# Altium schematic sheet H204_R_Sensors.SchDoc: H204 - Sensors
size A3; SheetNumber: 3; SheetTotal: 3; PageSetup: Record=PageOptions|CenterHorizontal=True|CenterVertical=True|PrintScale=0.63|XCorrection=1.00|YCorrection=1.00|PrintKind=0|BorderSize=5000000|LeftOffset=0|BottomOffset=0|Orientation=2|PaperLength=2794|PaperWidth=4318|Scale=100|PaperSource=7|PrintQuality=600|MediaType=1|DitherType=10|PaperKind=Legal (8 ½ x 14 in)|PrintScaleMode=1
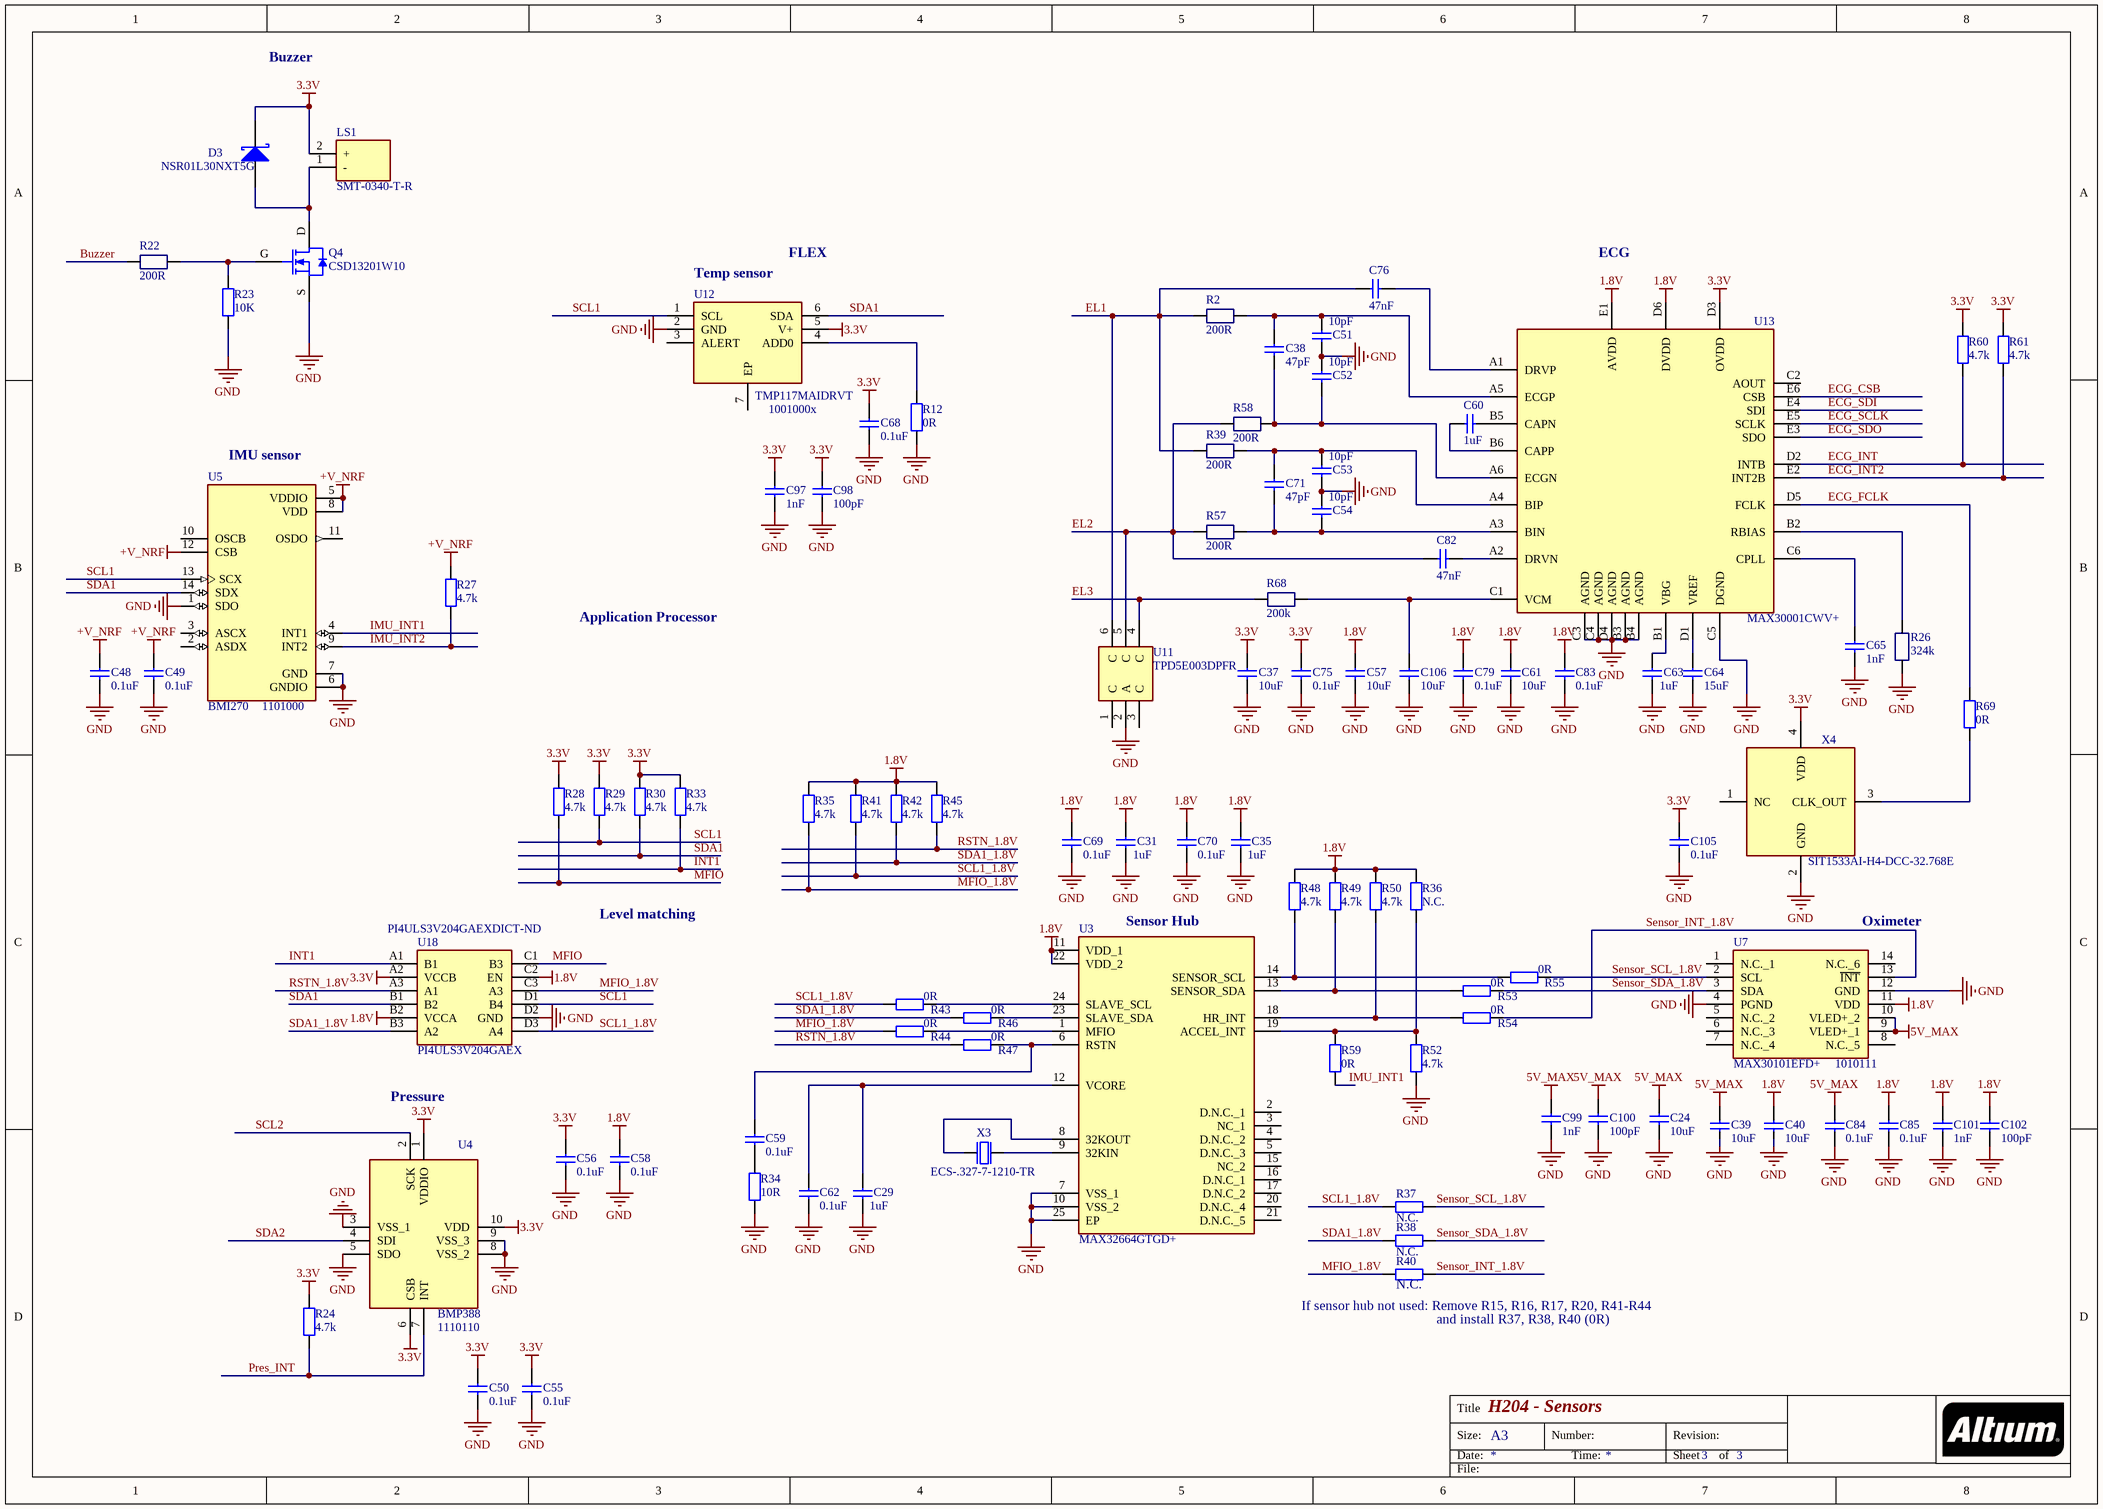
[diagram p0: H204_R_Sensors.SchDoc]

## Parts
C24  10uF  [CAPC1005X55N]
C29  1uF  [CAPC0603X33N]
C31  1uF  [CAPC0603X33N]
C35  1uF  [CAPC0603X33N]
C37  10uF  [CAPC1005X55N]
C38  47pF  [CAPC0603X33N]
C39  10uF  [CAPC1005X55N]
C40  10uF  [CAPC1005X55N]
C48  0.1uF  [CAPC0603X33N]
C49  0.1uF  [CAPC0603X33N]
C50  0.1uF  [CAPC0603X33N]
C51  10pF  [CAPC0603X33N]
C52  10pF  [CAPC0603X33N]
C53  10pF  [CAPC0603X33N]
C54  10pF  [CAPC0603X33N]
C55  0.1uF  [CAPC0603X33N]
C56  0.1uF  [CAPC0603X33N]
C57  10uF  [CAPC1005X55N]
C58  0.1uF  [CAPC0603X33N]
C59  0.1uF  [CAPC0603X33N]
C60  1uF  [CAPC0603X33N]
C61  10uF  [CAPC1005X55N]
C62  0.1uF  [CAPC0603X33N]
C63  1uF  [CAPC0603X33N]
C64  15uF  [CAPC1005X55N]
C65  1nF  [CAPC0603X33N]
C68  0.1uF  [CAPC0603X33N]
C69  0.1uF  [CAPC0603X33N]
C70  0.1uF  [CAPC0603X33N]
C71  47pF  [CAPC0603X33N]
C75  0.1uF  [CAPC0603X33N]
C76  47nF  [CAPC0603X33N]
C79  0.1uF  [CAPC0603X33N]
C82  47nF  [CAPC0603X33N]
C83  0.1uF  [CAPC0603X33N]
C84  0.1uF  [CAPC0603X33N]
C85  0.1uF  [CAPC0603X33N]
C97  1nF  [CAPC0603X33N]
C98  100pF  [CAPC0603X33N]
C99  1nF  [CAPC0603X33N]
C100  100pF  [CAPC0603X33N]
C101  1nF  [CAPC0603X33N]
C102  100pF  [CAPC0603X33N]
C105  0.1uF  [CAPC0603X33N]
C106  10uF  [CAPC1005X55N]
D3  NSR01L30NXT5G  [NSR01L30NXT5G]
LS1  SMT-0340-T-R  [SMT0340TR]
Q4  CSD13201W10  [CSD13201W10]
R2  200R  [RESC0603X26N]
R12  0R  [RESC0603X26N]
R22  200R  [RESC0603X26N]
R23  10k  [RESC0603X26N]
R24  4.7k  [RESC0603X26N]
R26  324k  [RESC0603X26N]
R27  4.7k  [RESC0603X26N]
R28  4.7k  [RESC0603X26N]
R29  4.7k  [RESC0603X26N]
R30  4.7k  [RESC0603X26N]
R33  4.7k  [RESC0603X26N]
R34  10R  [RESC0603X26N]
R35  4.7k  [RESC0603X26N]
R36  N.C.  [RESC0603X26N]
R37  N.C.  [RESC0603X26N]
R38  N.C.  [RESC0603X26N]
R39  200R  [RESC0603X26N]
R40  N.C.  [RESC0603X26N]
R41  4.7k  [RESC0603X26N]
R42  4.7k  [RESC0603X26N]
R43  0R  [RESC0603X26N]
R44  0R  [RESC0603X26N]
R45  4.7k  [RESC0603X26N]
R46  0R  [RESC0603X26N]
R47  0R  [RESC0603X26N]
R48  4.7k  [RESC0603X26N]
R49  4.7k  [RESC0603X26N]
R50  4.7k  [RESC0603X26N]
R52  4.7k  [RESC0603X26N]
R53  0R  [RESC0603X26N]
R54  0R  [RESC0603X26N]
R55  0R  [RESC0603X26N]
R57  200R  [RESC0603X26N]
R58  200R  [RESC0603X26N]
R59  0R  [RESC0603X26N]
R60  4.7k  [RESC0603X26N]
R61  4.7k  [RESC0603X26N]
R68  200k  [RESC0603X26N]
R69  0R  [RESC0603X26N]
U3  MAX32664GTGD+  [MAX32664GTGD]
U4  BMP388  [BMP388]
U5  BMI270  [XDCR_BMI270]
U7  MAX30101EFD+  [14-LEAD-OESIP]
U11  TPD5E003DPFR  [SON35P100X100X40-6N]
U12  TMP117MAIDRVT  [SON65P200X200X80-7N]
U13  MAX30001CWV+  [BGA30C50P6X5_293X274X69]
U18  PI4ULS3V204GAEX  Supplier Part Number 1: PI4ULS3V204GAEXDICT-ND  [BGA12C50P3X4_137X187X62]
X3  ECS-.327-7-1210-TR  [XTAL_ECS-.327-7-1210-TR]
X4  SIT1533AI-H4-DCC-32.768E  [SIT1533AIH4DCC32768E]

## Nets
1.8V: C31.1 C35.1 C40.1 C57.1 C58.1 C61.1 C69.1 C70.1 C79.1 C83.1 C85.1 C101.2 C102.1 R35.1 R36.1 R41.1 R42.1 R45.1 R48.1 R49.1 R50.1 U3.11(VDD_1) U3.22(VDD_2) U7.11(VDD) U13.D6(DVDD) U13.E1(AVDD) U18.B2(VCCA) U18.C2(EN)
3.3V: C37.1 C50.1 C55.1 C56.1 C68.1 C75.1 C97.2 C98.1 C105.1 D3.2(K) LS1.2(+) R24.1 R28.1 R29.1 R30.1 R33.1 R60.1 R61.1 U4.1(VDDIO) U4.6(CSB) U4.10(VDD) U12.5(V+) U13.D3(OVDD) U18.A2(VCCB) X4.4(VDD)
5V_MAX: C24.1 C39.1 C84.1 C99.2 C100.1 U7.9(VLED+_1) U7.10(VLED+_2)
+V_NRF: C48.1 C49.1 R27.1 U5.5(VDDIO) U5.8(VDD) U5.12(CSB)
GND: C24.2 C29.2 C31.2 C35.2 C37.2 C39.2 C40.2 C48.2 C49.2 C50.2 C51.1 C52.2 C53.1 C54.2 C55.2 C56.2 C57.2 C58.2 C61.2 C62.2 C63.2 C64.2 C65.2 C68.2 C69.2 C70.2 C75.2 C79.2 C83.2 C84.2 C85.2 C97.1 C98.2 C99.1 C100.2 C101.1 C102.2 C105.2 C106.2 Q4.S R12.1 R23.2 R26.1 R34.2 R52.2 U3.7(VSS_1) U3.10(VSS_2) U3.25(EP) U4.3(VSS_1) U4.5(SDO) U4.8(VSS_2) U4.9(VSS_3) U5.1(SDO) U5.6(GNDIO) U5.7(GND) U7.4(PGND) U7.12(GND) U11.2(A) U12.2(GND) U13.B3(AGND) U13.B4(AGND) U13.C3(AGND) U13.C4(AGND) U13.C5(DGND) U13.D4(AGND) U18.D2(GND) X4.2(GND)
Buzzer: R22.1
ECG_CSB: U13.E6(CSB)
ECG_FCLK: R69.2 U13.D5(FCLK)
ECG_INT: R60.2 U13.D2(INTB)
ECG_INT2: R61.2 U13.E2(INT2B)
ECG_SCLK: U13.E5(SCLK)
ECG_SDI: U13.E4(SDI)
ECG_SDO: U13.E3(SDO)
EL1: C76.2 R2.1 R39.1 U11.6(C)
EL2: C82.2 R57.1 R58.1 U11.5(C)
EL3: R68.2 U11.4(C)
IMU_INT1: R59.2 U5.4(INT1)
IMU_INT2: R27.2 U5.9(INT2)
INT1: R33.2 U18.A1(B1)
MFIO: R28.2 U18.C1(B3)
MFIO_1.8V: R35.2 R40.2 R44.1 U18.C3(A3)
Pres_INT: R24.2 U4.7(INT)
RSTN_1.8V: R45.2 R47.1 U18.A3(A1)
SCL1: R29.2 U5.13(SCX) U12.1(SCL) U18.D1(B4)
SCL1_1.8V: R37.2 R41.2 R43.1 U18.D3(A4)
SCL2: U4.2(SCK)
SDA1: R30.2 U5.14(SDX) U12.6(SDA) U18.B1(B2)
SDA1_1.8V: R38.2 R42.2 R46.1 U18.B3(A2)
SDA2: U4.4(SDI)
Sensor_INT_1.8V: R40.1 R54.2 U7.13(~{INT})
Sensor_SCL_1.8V: R37.1 R55.2 U7.2(SCL)
Sensor_SDA_1.8V: R38.1 R53.2 U7.3(SDA)
NetC29_1: C29.1 C62.1 U3.12(VCORE)
NetC38_1: C38.1 C52.1 R58.2 U13.A6(ECGN)
NetC38_2: C38.2 C51.2 R2.2 U13.A5(ECGP)
NetC53_2: C53.2 C71.2 R39.2 U13.A4(BIP)
NetC54_1: C54.1 C71.1 R57.2 U13.A3(BIN)
NetC59_1: C59.1 R47.2 U3.6(RSTN)
NetC59_2: C59.2 R34.1
NetC60_1: C60.1 U13.B6(CAPP)
NetC60_2: C60.2 U13.B5(CAPN)
NetC63_1: C63.1 U13.B1(VBG)
NetC64_1: C64.1 U13.D1(VREF)
NetC65_1: C65.1 U13.C6(CPLL)
NetC76_1: C76.1 U13.A1(DRVP)
NetC82_1: C82.1 U13.A2(DRVN)
NetC106_1: C106.1 R68.1 U13.C1(VCM)
NetD3_1: D3.1(A) LS1.1(-) Q4.D
NetQ4_G: Q4.G R22.2 R23.1
NetR12_2: R12.2 U12.4(ADD0)
NetR26_2: R26.2 U13.B2(RBIAS)
NetR36_2: R36.2 R52.1 R59.1 U3.19(ACCEL_INT)
NetR43_2: R43.2 U3.24(SLAVE_SCL)
NetR44_2: R44.2 U3.1(MFIO)
NetR46_2: R46.2 U3.23(SLAVE_SDA)
NetR48_2: R48.2 R55.1 U3.14(SENSOR_SCL)
NetR49_2: R49.2 R53.1 U3.13(SENSOR_SDA)
NetR50_2: R50.2 R54.1 U3.18(HR_INT)
NetR69_1: R69.1 X4.3(CLK_OUT)
NetU3_8: U3.8(32KOUT) X3.1(inp)
NetU3_9: U3.9(32KIN) X3.2(out)

Not connected (* = marked no-connect by the designer): U3 2(D.N.C._1) 3(NC_1) 4(D.N.C._2) 5(D.N.C._3) 15(NC_2) 16(D.N.C_1) 17(D.N.C_2) 20(D.N.C._4) 21(D.N.C._5); U5 2(ASDX) 3(ASCX) 10(OSCB) 11(OSDO); U7 1(N.C._1) 5(N.C._2) 6(N.C._3) 7(N.C._4) 8(N.C._5) 14(N.C._6); U11 1(C) 3(C); U12 3(ALERT) 7(EP); U13 C2(AOUT); X4 1(NC)

## Notes on the sheet
- Buzzer
- (near U12) Temp sensor
- FLEX
- ECG
- (near U12) 1001000x
- (near U5) IMU sensor
- Application Processor
- (near U5) 1101000
- Level matching
- (near U3) Sensor Hub
- (near U7) Oximeter
- Pressure
- (near U7) 1010111
- (near R40) If sensor hub not used: Remove R15, R16, R17, R20, R41-R44
- (near R40) and install R37, R38, R40 (0R)
- (near U4) 1110110
- Title
- Size:
- Date:
- A3
- Number:
- Time:
- Revision:
- Sheet
- of
- File:

## Library data of the parts
C24 C37 C39 C40 C57 C61 C106 = C0603-4µ7: CAP CER 10UF 10V X5R 0402; Manufacturer: Samsung; Manufacturer Part Number: CL05A106MP8NUB8; Tolerance: 20%; Value: 10uF; Supplier 1: Digi-Key; Supplier Part Number 1: 1276-6830-2-ND; RoHS: Yes; Category: Ceramic Capacitors; Stock 1: 5635891; Pricing 1: 8000=0,08247 (USD); Mount: Surface Mount; Case/Package: 0402; Case Code (Metric): 1005; Case Code (Imperial): 0402; Min Operating Temperature: -55°C; Max Operating Temperature: 85°C; Packaging: Tape and Reel; Capacitance: 10uF; Voltage Rating: 10V; Length: 0.039inch; Width: 0.02inch; Thickness: 0.035inch; RoHS Compliant: Yes; ComponentLink1URL: http://www.samsungsem.com/kr/support/product-search/mlcc/CL05A106MP8NUB8.jsp?src-supplier=Digi-Key; ComponentLink1Description: http://www.samsungsem.com/kr/support/product-search/mlcc/CL05A106MP8NUB8.jsp?src-supplier=Digi-Key
C29 C31 C35 C60 C63 = C0402-1µ0: CAP CER 1UF 6.3V X5R 0201; Manufacturer: Samsung; Manufacturer Part Number: CL03A105MQ3CSNC; Tolerance: 20%; Supplier 1: Digi-Key; Supplier Part Number 1: 1276-1325-1-ND; RoHS: Yes; Category: Ceramic Capacitors; Stock 1: 10; Pricing 1: 1=0,10000, 10=0,03500, 50=0,01940, 100=0,01580, 500=0,01128, 1000=0,00886, 2500=0,00805, 5000=0,00741 (USD); Mount: Surface Mount; Case/Package: 0201; Case Code (Metric): 0603; Case Code (Imperial): 0201; Min Operating Temperature: -55°C; Max Operating Temperature: 85°C; Package Quantity: 1; Packaging: Tape and Reel; Capacitance: 1uF; Voltage Rating: 6.3V; Dielectric: X5R; Series: CL; Length: 0.024inch; Width: 0.012inch; Thickness: 0.013inch; Depth: 0.3mm; Lead Free: Lead Free; RoHS Compliant: Yes; ComponentLink1URL: https://datasheet.ciiva.com/25786/cl03a105mq3csnc-25786759.pdf?src-supplier=Digi-Key; ComponentLink1Description: https://datasheet.ciiva.com/25786/cl03a105mq3csnc-25786759.pdf?src-supplier=Digi-Key; Value: 1uF
C38 C71 = C0402-100n: Cap Ceramic Monolithic 47pF 50VDC 1% SMD Paper T/R; Manufacturer: Murata; Manufacturer Part Number: GRM0335C1H470FA01D; Supplier 1: Digi-Key; Supplier Part Number 1: 490-GRM0335C1H470FA01DCT-ND; RoHS: Yes; Category: Ceramic Capacitors; Stock 1: 73266; Pricing 1: 1=0,10000, 10=0,02200, 50=0,01180, 100=0,00960, 500=0,00688, 1000=0,00541, 2500=0,00492, 5000=0,00452 (USD); RoHS Compliant: Yes
C48-C50 C55 C56 C58 C59 C62 C68-C70 C75 C79 C83-C85 C105 = C0201-100n: CAP CER 0.1UF 16V X5R 0201; Manufacturer: Samsung; Manufacturer Part Number: CL03A104KO3NNNC; Capacitance: 100nF; Tolerance: 10%; Value: 0.1uF; Supplier 1: Digi-Key; Supplier Part Number 1: 1276-1319-1-ND; RoHS: Yes; Category: Ceramic Capacitors; Stock 1: 1005663; Pricing 1: 1=0,12000, 10=0,08500, 50=0,04640, 100=0,03790, 500=0,02704, 1000=0,02125, 2500=0,01932, 5000=0,01777 (USD); Mount: Surface Mount; Case/Package: 0201; Case Code (Metric): 0603; Case Code (Imperial): 0201; Contact Plating: Tin; Min Operating Temperature: -55°C; Max Operating Temperature: 85°C; Package Quantity: 1; Packaging: Tape and Reel; Voltage Rating: 16V; Dielectric: X5R; Voltage Rating (DC): 16V; Series: CL; Construction: Flat; Length: 0.6mm; Width: 0.012inch; Height: 0.3mm; Thickness: 0.013inch; Depth: 0.3mm; Radiation Hardening: No; RoHS Compliant: Yes; ComponentLink1URL: https://datasheet.ciiva.com/25794/cl03a104ko3nnnc-25794320.pdf?src-supplier=Digi-Key; ComponentLink1Description: https://datasheet.ciiva.com/25794/cl03a104ko3nnnc-25794320.pdf?src-supplier=Digi-Key; ComponentLink2URL: https://datasheet.ciiva.com/26838/getdatasheetpartid-359638-26838082.pdf?src-supplier=Verical; ComponentLink2Description: https://datasheet.ciiva.com/26838/getdatasheetpartid-359638-26838082.pdf?src-supplier=Verical
C51-C54 = C0402-100n: MURATA - GRM0335C1H100JA01D - SMD Multilayer Ceramic Capacitor, 10 pF, 50 V, 0201 [0603 Metric], ± 5%, C0G / NP0, GRM Series; Voltage Rating: 50V; Supplier 1: Digi-Key; Supplier Part Number 1: 490-6112-1-ND; Manufacturer: Murata; Manufacturer Part Number: GRM0335C1H100JA01D; RoHS: Yes; Category: Ceramic Capacitors; Stock 1: 536566; Pricing 1: 1=0,10000, 10=0,01100, 50=0,00620, 100=0,00510, 500=0,00362, 1000=0,00285, 2500=0,00259, 5000=0,00238 (USD); Mount: Surface Mount; Case/Package: 0201; Case Code (Metric): 0603; Case Code (Imperial): 0201; Min Operating Temperature: -55°C; Max Operating Temperature: 125°C; Capacitance: 10pF; Tolerance: 5%; Voltage Rating (DC): 50V; Packaging: Tape and Reel; Package Quantity: 15000; Dielectric: C0G; Termination: SMD/SMT; Voltage: 50V; Series: GRM; Length: 0.6mm; Width: 0.3mm; Height: 0.3mm; Thickness: 0.013inch; Depth: 0.3mm; REACH SVHC: No SVHC; Lead Free: Lead Free; RoHS Compliant: Yes; ComponentLink1URL: https://datasheet.ciiva.com/6271/partnumbering-e-01-6271173.pdf?src-supplier=Digi-Key; ComponentLink1Description: https://datasheet.ciiva.com/6271/partnumbering-e-01-6271173.pdf?src-supplier=Digi-Key; ComponentLink2URL: https://datasheet.ciiva.com/6271/partnumbering-e-01-6271176.pdf?src-supplier=Digi-Key; ComponentLink2Description: https://datasheet.ciiva.com/6271/partnumbering-e-01-6271176.pdf?src-supplier=Digi-Key; ComponentLink3URL: https://datasheet.ciiva.com/6271/partnumbering-e-01-6271177.pdf?src-supplier=Digi-Key; ComponentLink3Description: https://datasheet.ciiva.com/6271/partnumbering-e-01-6271177.pdf?src-supplier=Digi-Key
C64 = C0603-4µ7: Cap Ceramic Monolithic 15uF 6.3VDC 20% SMD Paper T/R; Manufacturer: Murata; Manufacturer Part Number: GRM155R60J156ME05D; Value: 15uF; Supplier 1: Digi-Key; Supplier Part Number 1: 490-18659-1-ND; RoHS: Yes; Category: Ceramic Capacitors; Stock 1: 130616; Pricing 1: 1=0,28000, 10=0,19500, 50=0,13020, 100=0,11070, 500=0,07810, 1000=0,06834, 2500=0,06509, 5000=0,06021 (USD); RoHS Compliant: Yes
C65 C97 C99 C101 = C0402-100n: Cap Ceramic 0.001uF 25V X7R 10% SMD 0201 125C Paper T/R; Manufacturer: Samsung; Manufacturer Part Number: CL03B102KA3NNNC; Value: 1nF; Supplier 1: Digi-Key; Supplier Part Number 1: 1276-1341-1-ND; RoHS: Yes; Category: Ceramic Capacitors; Stock 1: 1034478; Pricing 1: 1=0,13000, 10=0,08900, 50=0,05080, 100=0,04200, 500=0,02946, 1000=0,02439, 2500=0,02270, 5000=0,02077 (USD); Mount: Surface Mount; Case/Package: 0201; Contact Plating: Tin; Case Code (Metric): 0603; Case Code (Imperial): 0201; Min Operating Temperature: -55°C; Max Operating Temperature: 125°C; Package Quantity: 1; Packaging: Tape and Reel; Capacitance: 1nF; Tolerance: 10%; Dielectric: X7R; Voltage Rating: 25V; Series: CL; Construction: Flat; Length: 0.6mm; Width: 0.012inch; Height: 0.3mm; Thickness: 0.013inch; Depth: 0.3mm; Radiation Hardening: No; RoHS Compliant: Yes; ComponentLink1URL: https://datasheet.ciiva.com/25788/cl03b102ka3nnnc-25788656.pdf?src-supplier=Digi-Key; ComponentLink1Description: https://datasheet.ciiva.com/25788/cl03b102ka3nnnc-25788656.pdf?src-supplier=Digi-Key; ComponentLink2URL: https://datasheet.ciiva.com/26838/getdatasheetpartid-355161-26838110.pdf?src-supplier=Verical; ComponentLink2Description: https://datasheet.ciiva.com/26838/getdatasheetpartid-355161-26838110.pdf?src-supplier=Verical
C76 C82 = C0402-100n: CAP CER 0.047UF 25V X5R 0201; Manufacturer: TDK; Manufacturer Part Number: C0603X5R1E473K030BB; Dielectric Material: Ceramic; Tolerance: 10%; Supplier 1: Digi-Key; Supplier Part Number 1: 445-13679-1-ND; RoHS: Yes; Category: Ceramic Capacitors; Stock 1: 131887; Pricing 1: 1=0,10000, 10=0,07600, 50=0,04140, 100=0,03380, 500=0,02416, 1000=0,01898, 2500=0,01725, 5000=0,01587 (USD); Mount: Surface Mount; Case/Package: 0201; Case Code (Metric): 0603; Case Code (Imperial): 0201; Weight: 6E-06oz; Min Operating Temperature: -55°C; Max Operating Temperature: 85°C; Package Quantity: 15000; Packaging: Tape and Reel; Capacitance: 47nF; Voltage Rating: 25V; Dielectric: X5R; Termination: SMD/SMT; Voltage Rating (DC): 25V; Series: C; Length: 0.024inch; Width: 0.3mm; Height: 0.3mm; Thickness: 0.013inch; Lead Free: Lead Free; RoHS Compliant: Yes; ComponentLink1URL: https://datasheet.ciiva.com/14887/tdkmlcccaprange-14887813.pdf?src-supplier=Digi-Key; ComponentLink1Description: https://datasheet.ciiva.com/14887/tdkmlcccaprange-14887813.pdf?src-supplier=Digi-Key; ComponentLink2URL: https://datasheet.ciiva.com/14887/tdkmlcccaprange-14887815.pdf?src-supplier=Digi-Key; ComponentLink2Description: https://datasheet.ciiva.com/14887/tdkmlcccaprange-14887815.pdf?src-supplier=Digi-Key; ComponentLink3URL: https://datasheet.ciiva.com/14887/tdkmlcccaprange-14887817.pdf?src-supplier=Digi-Key; ComponentLink3Description: https://datasheet.ciiva.com/14887/tdkmlcccaprange-14887817.pdf?src-supplier=Digi-Key
C98 C100 C102 = C0402-100n: CAP CER 100PF 50V C0G 0201; Manufacturer: TDK; Manufacturer Part Number: C0603C0G1H101J030BA; Dielectric Material: Ceramic; Tolerance: 5%; Insulation Resistance: 10GR; Value: 100pF; Supplier 1: Digi-Key; Supplier Part Number 1: 445-1786-1-ND; RoHS: Yes; Category: Ceramic Capacitors; Stock 1: 312493; Pricing 1: 1=0,10000, 10=0,06800, 50=0,03720, 100=0,03040, 500=0,02174, 1000=0,01708, 2500=0,01552, 5000=0,01428 (USD); Mount: Surface Mount; Case/Package: 0201; Number of Pins: 2; Case Code (Metric): 0603; Case Code (Imperial): 0201; Weight: 6E-06oz; Min Operating Temperature: -55°C; Max Operating Temperature: 125°C; Package Quantity: 1; Capacitance: 100pF; Voltage Rating: 50V; Packaging: Tape and Reel; Voltage Rating (DC): 50V; Dielectric: C0G; Termination: SMD/SMT; Construction: Flat; Voltage: 50V; Series: C; Length: 0.6mm; Width: 0.012inch; Height: 0.3mm; Depth: 0.3mm; Thickness: 0.013inch; Lead Free: Lead Free; REACH SVHC: Unknown; RoHS Compliant: Yes; ComponentLink1URL: https://datasheet.ciiva.com/24217/c0603c0g1h101j030ba-264106-24217425.pdf?src-supplier=Mouser; ComponentLink1Description: https://datasheet.ciiva.com/24217/c0603c0g1h101j030ba-264106-24217425.pdf?src-supplier=Mouser; ComponentLink2URL: https://datasheet.ciiva.com/16205/mlcc-commercial-general-en-16205590.pdf?src-supplier=Future+Electronics; ComponentLink2Description: https://datasheet.ciiva.com/16205/mlcc-commercial-general-en-16205590.pdf?src-supplier=Future+Electronics; ComponentLink3URL: https://datasheet.ciiva.com/6250/tdkmlcccaprange-6250351.pdf?src-supplier=Digi-Key; ComponentLink3Description: https://datasheet.ciiva.com/6250/tdkmlcccaprange-6250351.pdf?src-supplier=Digi-Key
D3 = Schottky: ON SEMICONDUCTOR - NSR01L30NXT5G - Small Signal Schottky Diode, Single, 30 V, 100 mA, 530 mV, 4 A, 150 °C; Forward Voltage: 530mV; Forward Current: 100mA; Max Repetitive Reverse Voltage (Vrrm): 30V; Max Forward Surge Current (Ifsm): 4A; Max Reverse Current: 3uA; Supplier 1: Digi-Key; Supplier Part Number 1: NSR01L30NXT5GOSCT-ND; Manufacturer: ON Semiconductor; Manufacturer Part Number: NSR01L30NXT5G; RoHS: Yes; Category: Schottky Diodes; Stock 1: 38186; Pricing 1: 1=0,43000, 10=0,32300, 100=0,20140, 500=0,13780, 1000=0,10600, 2000=0,09540 (USD); Case/Package: 0201; Number of Pins: 2; Max Operating Temperature: 150°C; Package Quantity: 5000; Packaging: Tape and Reel; Series: -; Average Rectified Current: 100mA; Peak Non-Repetitive Surge Current: 4A; Element Configuration: Single; Max Reverse Voltage (DC): 30V; Radiation Hardening: No; RoHS Compliant: Yes; REACH SVHC: No SVHC; Lead Free: Lead Free; ComponentLink1URL: https://datasheet.ciiva.com/4714/nsr01l30-d-118977-4714835.pdf?src-supplier=Mouser; ComponentLink1Description: https://datasheet.ciiva.com/4714/nsr01l30-d-118977-4714835.pdf?src-supplier=Mouser; ComponentLink2URL: https://datasheet.ciiva.com/22659/nsr01l30-d-22659110.pdf?src-supplier=Element14; ComponentLink2Description: https://datasheet.ciiva.com/22659/nsr01l30-d-22659110.pdf?src-supplier=Element14; ComponentLink3URL: https://datasheet.ciiva.com/8293/nsr01l30-d-8293831.pdf?src-supplier=Avnet; ComponentLink3Description: https://datasheet.ciiva.com/8293/nsr01l30-d-8293831.pdf?src-supplier=Avnet; ComponentLink4URL: https://datasheet.ciiva.com/6381/nsr01l30-d-6381900.pdf?src-supplier=Digi-Key; ComponentLink4Description: https://datasheet.ciiva.com/6381/nsr01l30-d-6381900.pdf?src-supplier=Digi-Key
LS1 = SMT-0340-T-R: Loudspeaker or Buzzer; Manufacturer: PUI Audio; Datasheet Link: http://www.puiaudio.com/pdf/SMT-0340-T-R.pdf; Height: 2mm; Manufacturer_Part_Number: SMT-0340-T-R; Mouser Part Number: 665-SMT-0340-T-R; Mouser Price/Stock: https://www.mouser.co.uk/ProductDetail/PUI-Audio/SMT-0340-T-R?qs=DPoM0jnrROXLQhGRbnNzhA%3D%3D; Manufacturer Part Number: SMT-0340-T-R; Supplier 1: Digi-Key; Supplier Part Number 1: 668-SMT-0340-T-RCT-ND
Q4 = Transistor N-channel: 12V, N ch NexFET MOSFET™, single WLP 1.0x1.0, 34mOhm 4-DSBGA -55 to 150; Manufacturer: Texas Instruments; Rds On Max: 34mR; Input Capacitance: 462pF; Continuous Drain Current (ID): 1.6A; Max Power Dissipation: 1.2W; Rise Time: 5.9ns; Number of Elements: 1; Turn-On Delay Time: 3.9ns; Turn-Off Delay Time: 14.4ns; Fall Time: 9.7ns; Gate to Source Voltage (Vgs): 8V; Supplier 1: Digi-Key; Supplier Part Number 1: 296-41412-1-ND; Manufacturer Part Number: CSD13201W10; RoHS: Yes; Category: MOSFETs; Stock 1: 204100; Pricing 1: 1=0,52000, 10=0,42400, 100=0,28860, 500=0,21648, 1000=0,16236 (USD); Mount: Surface Mount; Number of Pins: 4; Contact Plating: Copper,Tin,Silver; Min Operating Temperature: -55°C; Max Operating Temperature: 150°C; Package Quantity: 3000; Packaging: Tape and Reel; Drain to Source Voltage (Vdss): 12V; Power Dissipation: 1.2W; Element Configuration: Single; Number of Channels: 1; Drain to Source Breakdown Voltage: 12V; Drain to Source Resistance: 34mR; Lead Free: Lead Free; RoHS Compliant: Yes; ComponentLink1URL: https://datasheet.ciiva.com/30021/csd13201w10-30021961.pdf?src-supplier=Avnet; ComponentLink1Description: https://datasheet.ciiva.com/30021/csd13201w10-30021961.pdf?src-supplier=Avnet
R2 R22 R39 R57 R58 = Resistor: RES SMD 200 OHM 1% 1/20W 0201; Manufacturer: Yageo; Manufacturer Part Number: RC0201FR-07200RL; Voltage Rating: 25V; Power Rating: 50mW; Temperature Coefficient: 200ppm/°C; Value: 200R; Supplier 1: Digi-Key; Supplier Part Number 1: YAG2495CT-ND; RoHS: Yes; Category: Chip SMD Resistors; Stock 1: 262827; Pricing 1: 1=0,10000, 10=0,04200, 100=0,01700, 1000=0,00765, 2500=0,00664, 5000=0,00548 (USD); Case/Package: 0201; Case Code (Imperial): 0201; Case Code (Metric): 0603; Size Code: 0201; Min Operating Temperature: -55°C; Max Operating Temperature: 125°C; Package Quantity: 10000; Resistance: 200R; Tolerance: 1%; Packaging: Tape and Reel; Resistor Type: Thick Film; Termination: SMD/SMT; Number of Terminations: 2; Max Power Dissipation: 50mW; Features: Moisture Resistant; Series: RC; Construction: Rectangular; Length: 0.6mm; Width: 0.3mm; Height: 0.01inch; Depth: 0.3mm; Military Standard: Not; Lead Free: Lead Free; RoHS Compliant: Yes; ComponentLink1URL: http://components.arrow.com/part/dataview/0323_03297075?src-supplier=Arrow+Europe; ComponentLink1Description: http://components.arrow.com/part/dataview/0323_03297075?src-supplier=Arrow+Europe; ComponentLink2URL: http://www.mouser.com/ds/2/447/RC0201-559633.pdf?src-supplier=Mouser; ComponentLink2Description: http://www.mouser.com/ds/2/447/RC0201-559633.pdf?src-supplier=Mouser; ComponentLink3URL: http://www.yageo.com/documents/recent/PYu-RC_Group_51_RoHS_L_9.pdf?src-supplier=Digi-Key; ComponentLink3Description: http://www.yageo.com/documents/recent/PYu-RC_Group_51_RoHS_L_9.pdf?src-supplier=Digi-Key; ComponentLink4URL: http://www.yageo.com/documents/recent/PYu-RC_Group_51_RoHS_L_10.pdf?src-supplier=Digi-Key; ComponentLink4Description: http://www.yageo.com/documents/recent/PYu-RC_Group_51_RoHS_L_10.pdf?src-supplier=Digi-Key; ComponentLink5URL: http://www.yageo.com/documents/recent/PYu-RC0201_51_RoHS_L_(8).pdf?src-supplier=Future+Electronics; ComponentLink5Description: http://www.yageo.com/documents/recent/PYu-RC0201_51_RoHS_L_(8).pdf?src-supplier=Future+Electronics
R12 R43 R44 R46 R47 R53-R55 R59 R69 = Res2: Fixed Resistor, Metal Glaze/thick Film, 0.05W, 0ohm, Surface Mount, 0201; Manufacturer: Yageo; Manufacturer Part Number: AF0201JR-070RL; Resistance: 0mR; Max Power Dissipation: 50mW; Value: 0R; Supplier 1: Digi-Key; Supplier Part Number 1: 13-AF0201JR-070RLCT-ND; RoHS: Yes; Category: Chip SMD Resistors; Stock 1: 9; Pricing 1: 1=0,11000, 10=0,09500, 25=0,06560, 50=0,05100, 100=0,03640, 250=0,02840, 500=0,02256, 1000=0,01602, 5000=0,01238 (USD); Case/Package: 0201; Case Code (Imperial): 0201; Case Code (Metric): 0603; Weight: 6E-06oz; Min Operating Temperature: -55°C; Max Operating Temperature: 125°C; Packaging: Tape and Reel; Resistor Type: Thick Film; Number of Terminations: 2; Package Quantity: 10000; Termination: SMD/SMT; Features: Moisture Resistant,Anti-Sulfur; Length: 0.024inch; Width: 0.012inch; Height: 0.01inch; RoHS Compliant: Yes; ComponentLink1URL: http://www.mouser.com/ds/2/447/PYu-AF_51_RoHS_L_5-1085711.pdf?src-supplier=Mouser; ComponentLink1Description: http://www.mouser.com/ds/2/447/PYu-AF_51_RoHS_L_5-1085711.pdf?src-supplier=Mouser; ComponentLink2URL: http://www.yageo.com/documents/recent/PYu-AF_51_RoHS_L_5.pdf?src-supplier=Digi-Key; ComponentLink2Description: http://www.yageo.com/documents/recent/PYu-AF_51_RoHS_L_5.pdf?src-supplier=Digi-Key
R23 = Res2: GENERAL 0201 11% REEL (7INCH); Manufacturer: Yageo; Manufacturer Part Number: RC0201FR-0710KL; Resistance: 10kR; Tolerance: 1%; Temperature Coefficient: 200ppm/°C; Power Rating: 50mW; Voltage Rating: 25V; Value: 10K; Supplier 1: Digi-Key; Supplier Part Number 1: 311-10.0KMCT-ND; RoHS: Yes; Category: Chip SMD Resistors; Stock 1: 2380407; Pricing 1: 1=0,10000, 10=0,04200, 100=0,01700, 1000=0,00765, 2500=0,00664, 5000=0,00548 (USD); Case/Package: 0201; Number of Pins: 2; Contact Plating: Tin,Matte; Case Code (Imperial): 0201; Case Code (Metric): 0603; Weight: 6E-06oz; Min Operating Temperature: -55°C; Max Operating Temperature: 125°C; Resistor Type: Thick Film; Packaging: Tape and Reel; Package Quantity: 1; Termination: SMD/SMT; Number of Terminations: 2; Max Power Dissipation: 50mW; Voltage Rating (DC): 25V; Working Voltage: 25V; Features: Moisture Resistant; Series: RC; Technology: THICK FILM; Resistance Tolerance: 1%; Construction: Rectangular; Length: 0.6mm; Width: 0.3mm; Height: 0.01inch; Depth: 0.3mm; Radiation Hardening: No; REACH SVHC: No SVHC; Military Standard: Not; Lead Free: Lead Free; RoHS Compliant: Yes; ComponentLink1URL: https://datasheet.ciiva.com/2467/pyu-r-int-thick-7-2467109.pdf?src-supplier=Digi-Key; ComponentLink1Description: https://datasheet.ciiva.com/2467/pyu-r-int-thick-7-2467109.pdf?src-supplier=Digi-Key; ComponentLink2URL: https://datasheet.ciiva.com/2467/pyu-r-int-thick-7-2467110.pdf?src-supplier=Digi-Key; ComponentLink2Description: https://datasheet.ciiva.com/2467/pyu-r-int-thick-7-2467110.pdf?src-supplier=Digi-Key; ComponentLink3URL: https://datasheet.ciiva.com/2467/pyu-r-int-thick-7-2467111.pdf?src-supplier=Digi-Key; ComponentLink3Description: https://datasheet.ciiva.com/2467/pyu-r-int-thick-7-2467111.pdf?src-supplier=Digi-Key; ComponentLink4URL: https://datasheet.ciiva.com/7660/1421516-7660807.pdf?src-supplier=Element14; ComponentLink4Description: https://datasheet.ciiva.com/7660/1421516-7660807.pdf?src-supplier=Element14; ComponentLink5URL: https://datasheet.ciiva.com/8891/pyu-rc0201-51-rohs-l-8-8891384.pdf?src-supplier=Avnet; ComponentLink5Description: https://datasheet.ciiva.com/8891/pyu-rc0201-51-rohs-l-8-8891384.pdf?src-supplier=Avnet; ComponentLink6URL: https://datasheet.ciiva.com/28405/pyu-rc0201-51-rohs-l-8-28405609.pdf?src-supplier=Avnet+Europe; ComponentLink6Description: https://datasheet.ciiva.com/28405/pyu-rc0201-51-rohs-l-8-28405609.pdf?src-supplier=Avnet+Europe; ComponentLink7URL: https://datasheet.ciiva.com/26829/getdatasheetpartid-421074-26829851.pdf?src-supplier=Verical; ComponentLink7Description: https://datasheet.ciiva.com/26829/getdatasheetpartid-421074-26829851.pdf?src-supplier=Verical; ComponentLink8URL: https://datasheet.ciiva.com/46391/1421516-46391339.pdf?src-supplier=Element14; ComponentLink8Description: https://datasheet.ciiva.com/46391/1421516-46391339.pdf?src-supplier=Element14; ComponentLink9URL: https://datasheet.ciiva.com/16855/pyu-rc0201-51-rohs-l-8-16855789.pdf?src-supplier=Avnet+Europe; ComponentLink9Description: https://datasheet.ciiva.com/16855/pyu-rc0201-51-rohs-l-8-16855789.pdf?src-supplier=Avnet+Europe
R24 R27-R30 R33 R35 R41 R42 R45 R48-R50 R52 R60 R61 = Res2: GENERAL 0201 11% REEL (7INCH); Manufacturer: Yageo; Manufacturer Part Number: RC0201FR-074K7L; Resistance: 4.7kR; Tolerance: 1%; Temperature Coefficient: 200ppm/°C; Power Rating: 50mW; Voltage Rating: 25V; Value: 4.7k; Supplier 1: Digi-Key; Supplier Part Number 1: 311-4.70KMCT-ND; RoHS: Yes; Category: Chip SMD Resistors; Stock 1: 638424; Pricing 1: 1=0,10000, 10=0,04200, 100=0,01700, 1000=0,00765, 2500=0,00664, 5000=0,00548 (USD); Case/Package: 0201; Contact Plating: Tin,Matte; Case Code (Metric): 0603; Case Code (Imperial): 0201; Weight: 6E-06oz; Size Code: 0201; Min Operating Temperature: -55°C; Max Operating Temperature: 125°C; Resistor Type: Thick Film; Packaging: Tape and Reel; Package Quantity: 1; Number of Terminations: 2; Termination: SMD/SMT; Max Power Dissipation: 50mW; Features: Moisture Resistant; Series: RC; Resistance Tolerance: 1%; Construction: Rectangular; Length: 0.6mm; Width: 0.012inch; Height: 0.01inch; Depth: 0.3mm; Radiation Hardening: No; REACH SVHC: Unknown; Military Standard: Not; Lead Free: Lead Free; RoHS Compliant: Yes; ComponentLink1URL: https://datasheet.ciiva.com/2493/pyu-r-int-thick-7-2493811.pdf?src-supplier=Digi-Key; ComponentLink1Description: https://datasheet.ciiva.com/2493/pyu-r-int-thick-7-2493811.pdf?src-supplier=Digi-Key; ComponentLink2URL: https://datasheet.ciiva.com/2493/pyu-r-int-thick-7-2493812.pdf?src-supplier=Digi-Key; ComponentLink2Description: https://datasheet.ciiva.com/2493/pyu-r-int-thick-7-2493812.pdf?src-supplier=Digi-Key; ComponentLink3URL: https://datasheet.ciiva.com/2493/pyu-r-int-thick-7-2493813.pdf?src-supplier=Digi-Key; ComponentLink3Description: https://datasheet.ciiva.com/2493/pyu-r-int-thick-7-2493813.pdf?src-supplier=Digi-Key; ComponentLink4URL: https://datasheet.ciiva.com/7672/1563626-7672233.pdf?src-supplier=Element14; ComponentLink4Description: https://datasheet.ciiva.com/7672/1563626-7672233.pdf?src-supplier=Element14; ComponentLink5URL: https://datasheet.ciiva.com/28410/pyu-rc0201-51-rohs-l-8-28410061.pdf?src-supplier=Avnet+Europe; ComponentLink5Description: https://datasheet.ciiva.com/28410/pyu-rc0201-51-rohs-l-8-28410061.pdf?src-supplier=Avnet+Europe; ComponentLink6URL: https://datasheet.ciiva.com/8892/pyu-rc0201-51-rohs-l-8-8892942.pdf?src-supplier=Avnet; ComponentLink6Description: https://datasheet.ciiva.com/8892/pyu-rc0201-51-rohs-l-8-8892942.pdf?src-supplier=Avnet
R26 = Resistor: Res Thick Film 0201 324K Ohm 1% 1/20W ±200ppm/°C Molded SMD Paper T/R; Manufacturer: Yageo; Manufacturer Part Number: RC0201FR-07324KL; Resistance: 324kR; Max Power Dissipation: 50mW; Value: 324k; Supplier 1: Digi-Key; Supplier Part Number 1: YAG2599CT-ND; RoHS: Yes; Category: Chip SMD Resistors; Stock 1: 23; Pricing 1: 1=0,10000, 10=0,04200, 100=0,01700, 1000=0,00765, 2500=0,00664, 5000=0,00548 (USD); Case/Package: 0201; Case Code (Metric): 0603; Case Code (Imperial): 0201; Min Operating Temperature: -55°C; Max Operating Temperature: 125°C; Packaging: Tape and Reel; Resistor Type: Thick Film; Number of Terminations: 2; Tolerance: 1%; Temperature Coefficient: 200ppm/°C; Features: Moisture Resistant; Length: 0.024inch; Width: 0.012inch; Height: 0.01inch; RoHS Compliant: Yes; ComponentLink1URL: http://www.yageo.com.tw/exep/pages/download/literatures/PYu-R_INT-thick_7.pdf?src-supplier=Digi-Key; ComponentLink1Description: http://www.yageo.com.tw/exep/pages/download/literatures/PYu-R_INT-thick_7.pdf?src-supplier=Digi-Key; ComponentLink2URL: http://www.yageo.com/documents/recent/PYu-RC_Group_51_RoHS_L_10.pdf?src-supplier=Digi-Key; ComponentLink2Description: http://www.yageo.com/documents/recent/PYu-RC_Group_51_RoHS_L_10.pdf?src-supplier=Digi-Key
R34 = Res2: RES SMD 10 OHM 1% 1/20W 0201; Manufacturer: Yageo; Manufacturer Part Number: RC0201FR-0710RL; Power Rating: 50mW; Voltage Rating: 25V; Temperature Coefficient: 350ppm/°C; Value: 10R; Supplier 1: Digi-Key; Supplier Part Number 1: 311-10.0MCT-ND; RoHS: Yes; Category: Chip SMD Resistors; Stock 1: 241011; Pricing 1: 1=0,10000, 10=0,06300, 100=0,02560, 1000=0,01149, 2500=0,00997, 5000=0,00824 (USD); Case/Package: 0201; Case Code (Imperial): 0201; Case Code (Metric): 0603; Contact Plating: Tin,Matte; Size Code: 0201; Min Operating Temperature: -55°C; Max Operating Temperature: 125°C; Resistance: 10R; Tolerance: 1%; Packaging: Tape and Reel; Package Quantity: 1; Termination: SMD/SMT; Resistor Type: Thick Film; Number of Terminations: 2; Max Power Dissipation: 50mW; Features: Moisture Resistant; Series: RC; Resistance Tolerance: 1%; Length: 0.024inch; Width: 0.012inch; Height: 0.01inch; Radiation Hardening: No; REACH SVHC: No SVHC; Lead Free: Lead Free; RoHS Compliant: Yes; ComponentLink1URL: https://datasheet.ciiva.com/7672/1563626-7672197.pdf?src-supplier=Element14; ComponentLink1Description: https://datasheet.ciiva.com/7672/1563626-7672197.pdf?src-supplier=Element14; ComponentLink2URL: https://datasheet.ciiva.com/28405/pyu-rc0201-51-rohs-l-8-28405493.pdf?src-supplier=Avnet+Europe; ComponentLink2Description: https://datasheet.ciiva.com/28405/pyu-rc0201-51-rohs-l-8-28405493.pdf?src-supplier=Avnet+Europe; ComponentLink3URL: https://datasheet.ciiva.com/16855/pyu-rc0201-51-rohs-l-8-16855798.pdf?src-supplier=Avnet+Europe; ComponentLink3Description: https://datasheet.ciiva.com/16855/pyu-rc0201-51-rohs-l-8-16855798.pdf?src-supplier=Avnet+Europe; ComponentLink4URL: https://datasheet.ciiva.com/5757/1563626-5757896.pdf?src-supplier=Farnell; ComponentLink4Description: https://datasheet.ciiva.com/5757/1563626-5757896.pdf?src-supplier=Farnell; ComponentLink5URL: https://datasheet.ciiva.com/2467/pyu-r-int-thick-7-2467097.pdf?src-supplier=Digi-Key; ComponentLink5Description: https://datasheet.ciiva.com/2467/pyu-r-int-thick-7-2467097.pdf?src-supplier=Digi-Key; ComponentLink6URL: https://datasheet.ciiva.com/2467/pyu-r-int-thick-7-2467098.pdf?src-supplier=Digi-Key; ComponentLink6Description: https://datasheet.ciiva.com/2467/pyu-r-int-thick-7-2467098.pdf?src-supplier=Digi-Key; ComponentLink7URL: https://datasheet.ciiva.com/2467/pyu-r-int-thick-7-2467099.pdf?src-supplier=Digi-Key; ComponentLink7Description: https://datasheet.ciiva.com/2467/pyu-r-int-thick-7-2467099.pdf?src-supplier=Digi-Key
R36-R38 R40 = Res2: Resistor; Value: N.C.
R68 = Resistor: Thick Film Resistors - SMD 200K OHM 1%; Manufacturer: Yageo; Manufacturer Part Number: RC0201FR-07200KL; Resistance: 200kR; Power Rating: 50mW; Voltage Rating: 25V; Temperature Coefficient: 200ppm/°C; Value: 200k; Supplier 1: Digi-Key; Supplier Part Number 1: YAG2275CT-ND; RoHS: Yes; Category: Chip SMD Resistors; Stock 1: 66949; Pricing 1: 1=0,10000, 10=0,04200, 100=0,01700, 1000=0,00765, 2500=0,00664, 5000=0,00548 (USD); Case/Package: 0201; Case Code (Metric): 0603; Case Code (Imperial): 0201; Size Code: 0201; Min Operating Temperature: -55°C; Max Operating Temperature: 125°C; Package Quantity: 10000; Packaging: Tape and Reel; Tolerance: 1%; Resistor Type: Thick Film; Number of Terminations: 2; Termination: SMD/SMT; Max Power Dissipation: 50mW; Features: Moisture Resistant; Series: RC; Length: 0.024inch; Width: 0.012inch; Height: 0.01inch; Lead Free: Lead Free; RoHS Compliant: Yes; ComponentLink1URL: https://datasheet.ciiva.com/14985/pyu-r-int-thick-7-14985445.pdf?src-supplier=Digi-Key; ComponentLink1Description: https://datasheet.ciiva.com/14985/pyu-r-int-thick-7-14985445.pdf?src-supplier=Digi-Key
U3 = MAX32664GTGD+: Integrated Circuit; Manufacturer: Maxim; Supplier 1: Digi-Key; Supplier Part Number 1: 175-MAX32664GTGD+-ND; Manufacturer Part Number: MAX32664GTGD+; RoHS: Yes; Pricing 1: 490=4,49196 (USD)
U4 = BMP388: Pressure Sensor 30kPa to 125kPa Absolute 10-Pin LGA; Manufacturer: Bosch Sensortec; Output Type: SPI,I2C; Operating Pressure: 18.13PSI; Port Style: No Port; Drain to Source Voltage (Vdss): 30V; Continuous Drain Current (ID): 4A; Rds On Max: 50mR; Input Capacitance: 645pF; Max Power Dissipation: 1.4W; Capacitance: 4.7uF; Tolerance: 20%; Voltage Rating: 16V; Supplier 1: Digi-Key; Supplier Part Number 1: 828-1079-1-ND; Manufacturer Part Number: BMP388; RoHS: No; Category: Pressure Sensors; Pricing 1: 1=3,990000, 5=3,520000, 10=3,108000, 25=2,522000, 50=2,228800, 100=2,170000 (USD); Mount: Surface Mount; Case/Package: LGA; Number of Pins: 10; Case Code (Imperial): 0805; Case Code (Metric): 2012; Min Operating Temperature: -55°C; Max Operating Temperature: 150°C; Features: Soft Termination; Pressure Type: Absolute; Termination: SMD/SMT; Packaging: Tape and Reel; Ratings: AEC-Q200; ComponentLink1URL: https://ae-bst.resource.bosch.com/media/_tech/media/datasheets/BST-BMP388-DS001.pdf?src-supplier=Digi-Key; ComponentLink1Description: https://ae-bst.resource.bosch.com/media/_tech/media/datasheets/BST-BMP388-DS001.pdf?src-supplier=Digi-Key; ComponentLink2URL: https://ae-bst.resource.bosch.com/media/_tech/media/product_flyer/BST-BMP388-FL000-00.pdf?src-supplier=Digi-Key; ComponentLink2Description: https://ae-bst.resource.bosch.com/media/_tech/media/product_flyer/BST-BMP388-FL000-00.pdf?src-supplier=Digi-Key; ComponentLink3URL: https://ae-bst.resource.bosch.com/media/_tech/media/application_notes/BST-BMP380-HS000.pdf?src-supplier=Digi-Key; ComponentLink3Description: https://ae-bst.resource.bosch.com/media/_tech/media/application_notes/BST-BMP380-HS000.pdf?src-supplier=Digi-Key
U5 = BMI270: BMI270 Series 3.6 V 685 µA Smart Ultra-low Power Inertial Measurement Unit; Manufacturer: Bosch Sensortec; Supplier 1: Digi-Key; Supplier Part Number 1: 828-1091-1-ND; Manufacturer Part Number: BMI270; RoHS: No
U7 = MAX30101EFD+: Analog Circuit, 1 Func; Manufacturer: Maxim; Min Supply Voltage: 1.7V; Max Supply Voltage: 2V; Supplier 1: Digi-Key; Supplier Part Number 1: MAX30101EFD+-ND; Manufacturer Part Number: MAX30101EFD+; RoHS: Yes; Category: Sensors; Stock 1: 3923; Pricing 1: 1=8,97000, 10=8,10600, 25=7,72840, 364=6,40901, 728=5,84350, 1092=5,08950 (USD); Number of Pins: 14; Min Operating Temperature: -40°C; Max Operating Temperature: 85°C; REACH SVHC: No SVHC; ComponentLink1URL: http://www.farnell.com/datasheets/2064242.pdf?src-supplier=Farnell; ComponentLink1Description: http://www.farnell.com/datasheets/2064242.pdf?src-supplier=Farnell; ComponentLink2URL: http://www.farnell.com/datasheets/2064242.pdf?src-supplier=Element14; ComponentLink2Description: http://www.farnell.com/datasheets/2064242.pdf?src-supplier=Element14; ComponentLink3URL: https://datasheets.maximintegrated.com/en/ds/MAX30101.pdf?src-supplier=Digi-Key; ComponentLink3Description: https://datasheets.maximintegrated.com/en/ds/MAX30101.pdf?src-supplier=Digi-Key; ComponentLink4URL: http://datasheets.maximintegrated.com/en/ds/MAX30101.pdf?src-supplier=Newark; ComponentLink4Description: http://datasheets.maximintegrated.com/en/ds/MAX30101.pdf?src-supplier=Newark; ComponentLink5URL: http://datasheets.maximintegrated.com/en/ds/MAX30101.pdf?src-supplier=Mouser; ComponentLink5Description: http://datasheets.maximintegrated.com/en/ds/MAX30101.pdf?src-supplier=Mouser; ComponentLink6URL: http://datasheets.maximintegrated.com/en/ds/MAX30101.pdf?src-supplier=Avnet+Europe; ComponentLink6Description: http://datasheets.maximintegrated.com/en/ds/MAX30101.pdf?src-supplier=Avnet+Europe; ComponentLink7URL: http://datasheets.maximintegrated.com/en/ds/MAX30101.pdf?src-supplier=Avnet; ComponentLink7Description: http://datasheets.maximintegrated.com/en/ds/MAX30101.pdf?src-supplier=Avnet; ComponentLink8URL: http://datasheets.maximintegrated.com/en/ds/MAX30101.pdf?src-supplier=Component+Sense; ComponentLink8Description: http://datasheets.maximintegrated.com/en/ds/MAX30101.pdf?src-supplier=Component+Sense
U11 = SP0505BAJTG: ESD Suppressors Five CH Space Saving ESD Protect Device; Manufacturer: Texas Instruments; Capacitance: 8.4pF; Operating Supply Voltage: 5.5V; Direction: Unidirectional; Number of Unidirectional Channels: 5; Number of Bidirectional Channels: 4; Reverse Standoff Voltage: 5V; Min Breakdown Voltage: 6V; Clamping Voltage: 15.6V; Peak Pulse Power: 40W; Power Line Protection: No; Peak Pulse Current: 10A; Diode Type: ZENER; Supplier 1: Digi-Key; Supplier Part Number 1: 296-43577-1-ND; Manufacturer Part Number: TPD5E003DPFR; RoHS: Yes; Category: Integrated Circuits (ICs); Stock 1: 1694; Pricing 1: 1=0,65000, 10=0,56000, 100=0,41850, 500=0,32882, 1000=0,25408, 2000=0,24675 (USD); Mount: Surface Mount; Number of Pins: 6; Min Operating Temperature: -40°C; Max Operating Temperature: 125°C; Package Quantity: 5000; Packaging: Tape and Reel; Breakdown Voltage: 6V; Number of Channels: 5; Termination: SMD/SMT; Polarity: Unidirectional; Working Voltage: 5V; Max Power Dissipation: 40W; Resistor Type: Zener; Series: -; Lead Free: Lead Free; RoHS Compliant: Yes; ComponentLink1URL: https://datasheet.ciiva.com/6577/tpd5e003-6577651.pdf?src-supplier=Digi-Key; ComponentLink1Description: https://datasheet.ciiva.com/6577/tpd5e003-6577651.pdf?src-supplier=Digi-Key
U12 = TMP117MAIDRVT: ±0.1°C accurate digital temperature sensor with integrated NV memory 6-WSON 0 to 85; Manufacturer: Texas Instruments; Output Type: I2C; Resolution: 16b; Supplier 1: Digi-Key; Supplier Part Number 1: 296-52215-1-ND; Manufacturer Part Number: TMP117MAIDRVT; RoHS: Yes; Category: Integrated Circuits (ICs); Stock 1: 4230; Pricing 1: 1=4,89000, 5=4,31400, 10=3,81100, 25=3,09160, 50=2,73220, 100=2,66030 (USD); Mount: Surface Mount; Min Operating Temperature: -55°C; Max Operating Temperature: 150°C; Packaging: Tape and Reel; RoHS Compliant: Yes; ComponentLink1URL: http://www.ti.com/lit/gpn/tmp117?src-supplier=Digi-Key; ComponentLink1Description: http://www.ti.com/lit/gpn/tmp117?src-supplier=Digi-Key
U13 = MAX30001CWV+: Biopotential/bioz Afe, WLP-30; Manufacturer_Name: Maxim Integrated; Manufacturer: Maxim; Datasheet Link: https://datasheets.maximintegrated.com/en/ds/MAX30001.pdf; Height: 0.69mm; Manufacturer_Part_Number: MAX30001CWV+; Mouser Part Number: 700-MAX30001CWV+; Mouser Price/Stock: https://www.mouser.co.uk/ProductDetail/Maxim-Integrated/MAX30001CWV%2b?qs=gt1LBUVyoHlQ9wjGIPyD2Q%3D%3D; Supplier 1: Digi-Key; Supplier Part Number 1: MAX30001CWV+-ND; Manufacturer Part Number: MAX30001CWV+; RoHS: Yes; Category: Sensors; Stock 1: 1; Pricing 1: 1=9,16000 (USD); RoHS Compliant: Yes
U18 = PI4ULS3V204GAEX: UNIVERSAL BI-DIRECTIONALEVEL; Manufacturer_Name: Diodes Inc.; Manufacturer: Diodes; Logic Function: Level Shifter; Low Level Output Current: 1mA; High Level Output Current: -20uA; Datasheet Link: https://www.diodes.com/assets/Datasheets/PI4ULS3V204.pdf; Height: 0.625mm; Manufacturer_Part_Number: PI4ULS3V204GAEX; Mouser Part Number: 729-PI4ULS3V204GAEX; Mouser Price/Stock: https://www.mouser.co.uk/ProductDetail/Diodes-Incorporated/PI4ULS3V204GAEX?qs=A65YvgP4j%252BEWb8XHzZsSTA%3D%3D; Arrow Part Number: PI4ULS3V204GAEX; Arrow Price/Stock: https://www.arrow.com/en/products/pi4uls3v204gaex/diodes-incorporated; Supplier 1: Digi-Key; Manufacturer Part Number: PI4ULS3V204GAEX; RoHS: Yes; Category: Integrated Circuits (ICs); Stock 1: 3000; Pricing 1: 1=1,05000, 10=0,93800, 25=0,89040, 100=0,73140, 250=0,68368, 500=0,60420, 1000=0,47700 (USD); Mount: Surface Mount; Min Operating Temperature: -40°C; Max Operating Temperature: 85°C; Packaging: Tape and Reel; Lead Free: Lead Free; RoHS Compliant: Yes; ComponentLink1URL: https://www.diodes.com/assets/Datasheets/PI4ULS3V204.pdf?src-supplier=Digi-Key; ComponentLink1Description: https://www.diodes.com/assets/Datasheets/PI4ULS3V204.pdf?src-supplier=Digi-Key; ComponentLink2URL: https://www.pericom.com/assets/Datasheets/PI4ULS3V204.pdf?src-supplier=Avnet+Asia; ComponentLink2Description: https://www.pericom.com/assets/Datasheets/PI4ULS3V204.pdf?src-supplier=Avnet+Asia
X3 = XTAL_SMD2016_32MHz_8pF_Epson: Crystal 32.7680Khz 6Pf Smd / Tape & Reel (Tr) Rohs Compliant: Yes; Manufacturer: ECS International; Supplier 1: Digi-Key; Supplier Part Number 1: XC2284CT-ND; Manufacturer Part Number: ECS-.327-7-1210-TR; RoHS: Yes; Stock 1: 200; Pricing 1: 1=1,63000, 10=1,56100, 50=1,52460, 100=1,30680, 500=1,27050, 1000=1,07085, 2500=1,01640 (USD)
X4 = SIT1533AI-H4-DCC-32.768E: Oscillator MEMS 0.032768MHz ±100ppm (Stability) LVCMOS 52% 1.8V/2.5V/3.3V 4-Pin SMD T/R; Manufacturer_Name: SiTime; Frequency: 32.768kHz; Max Supply Current: 1.4uA; Load Capacitance: 10pF; Min Supply Voltage: 1.5V; Max Supply Voltage: 3.63V; Current Rating: 1.35uA; Datasheet Link: https://www.sitime.com/datasheet/SiT1533; Height: 0.6mm; Manufacturer_Part_Number: SIT1533AI-H4-DCC-32.768E; Mouser Part Number: 788-1533AIH4DCC32.76; Mouser Price/Stock: https://www.mouser.co.uk/ProductDetail/SiTime/SiT1533AI-H4-DCC-32768E?qs=5SDzjInHUKoUZz9ePr9JwA%3D%3D; Arrow Part Number: SIT1533AI-H4-DCC-32.768E; Arrow Price/Stock: https://www.arrow.com/en/products/sit1533ai-h4-dcc-32.768e/sitime; Supplier 1: Digi-Key; Supplier Part Number 1: 1473-1239-1-ND; Manufacturer: SiTime; Manufacturer Part Number: SIT1533AI-H4-DCC-32.768E; RoHS: Yes; Category: Oscillators; Stock 1: 75387; Pricing 1: 1=1,10000, 10=0,97500, 50=0,91160, 100=0,80560, 500=0,76320 (USD); Mount: Surface Mount; Case/Package: SMD/SMT; Number of Pins: 4; Min Operating Temperature: -40°C; Max Operating Temperature: 85°C; Packaging: Tape and Reel; Frequency Stability: 100ppm; Termination: SMD/SMT; Max Duty Cycle: 52%; Package Quantity: 1000; Length: 0.079inch; Width: 0.047inch; RoHS Compliant: Yes; ComponentLink1URL: http://www.mouser.com/ds/2/371/SiT1533-datasheet-275337.pdf?src-supplier=Mouser; ComponentLink1Description: http://www.mouser.com/ds/2/371/SiT1533-datasheet-275337.pdf?src-supplier=Mouser; ComponentLink2URL: http://components.arrow.com/part/dataview/0323_07137603?src-supplier=Arrow+Europe; ComponentLink2Description: http://components.arrow.com/part/dataview/0323_07137603?src-supplier=Arrow+Europe; ComponentLink3URL: https://www.sitime.com/datasheet/SiT1533?src-supplier=Digi-Key; ComponentLink3Description: https://www.sitime.com/datasheet/SiT1533?src-supplier=Digi-Key